# EAGLE design ch552_atmega328p (EAGLE 9.5.0)
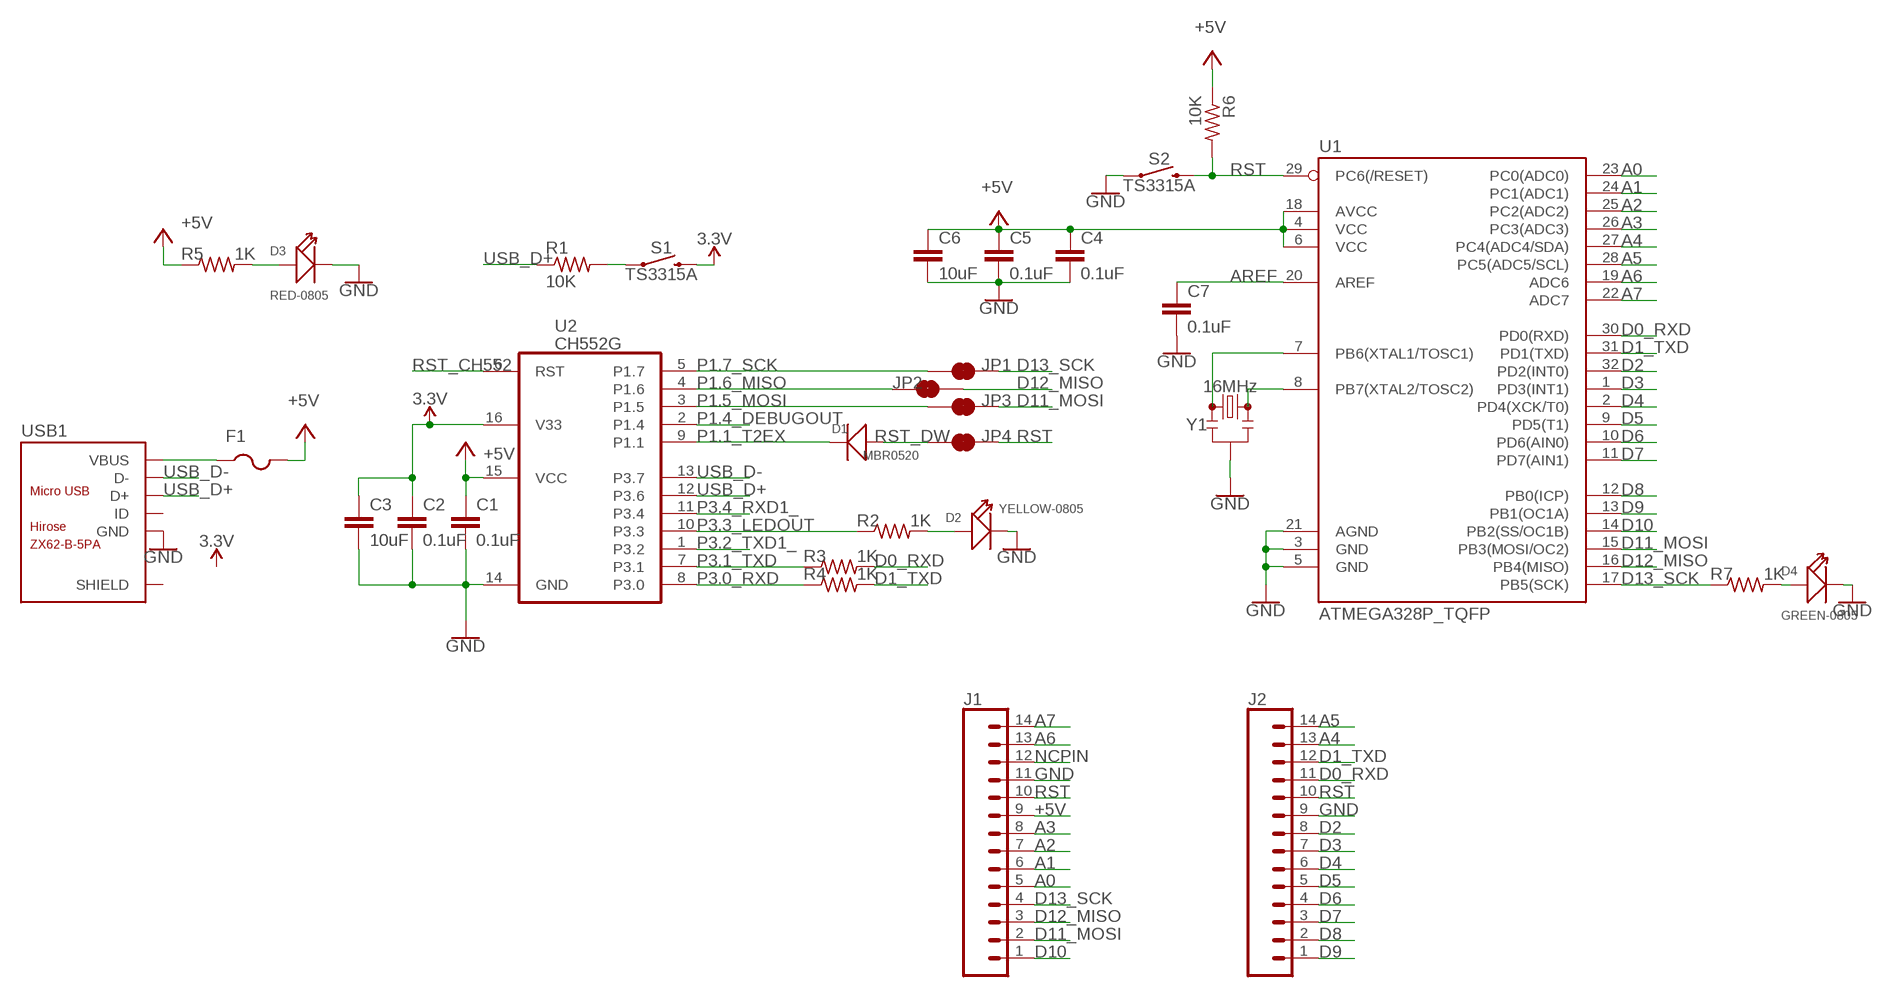
[diagram p0: schematic, sheet 1]

## Parts
C1  0.1uF  C-EUC0805K  [C0805K]
C2  0.1uF  C-EUC0805K  [C0805K]
C3  10uF  C-EUC0805K  [C0805K]
C4  0.1uF  C-EUC0805K  [C0805K]
C5  0.1uF  C-EUC0805K  [C0805K]
C6  10uF  C-EUC0805K  [C0805K]
C7  0.1uF  C-EUC0805K  [C0805K]
D1  MBR0520  SMD-DIODE-100V-200MA(SOD-123)  [SOD-123]
D2  YELLOW-0805  SMD-LED-CLEAR-YELLOW(0805)  [LED-0805]
D3  RED-0805  SMD-LED-CLEAR-RED(0805)  [LED-0805]
D4  GREEN-0805  SMD-LED-CLEAR-GREEN(0805)  [LED-0805]
F1  PTCFUSE-1206  [R1206]
J1  CONN_14NO_SILK  [1X14_NO_SILK]
J2  CONN_14NO_SILK  [1X14_NO_SILK]
JP1  JUMPER-SMT_2_NC_TRACE_NO-SILK  [SMT-JUMPER_2_NC_TRACE_NO-SILK]
JP2  JUMPER-SMT_2_NC_TRACE_NO-SILK  [SMT-JUMPER_2_NC_TRACE_NO-SILK]
JP3  JUMPER-SMT_2_NC_TRACE_NO-SILK  [SMT-JUMPER_2_NC_TRACE_NO-SILK]
JP4  JUMPER-SMT_2_NC_TRACE_NO-SILK  [SMT-JUMPER_2_NC_TRACE_NO-SILK]
R1  10K  R-US_R0805  [R0805]
R2  1K  R-US_R0805  [R0805]
R3  1K  R-US_R0805  [R0805]
R4  1K  R-US_R0805  [R0805]
R5  1K  R-US_R0805  [R0805]
R6  10K  R-US_R0805  [R0805]
R7  1K  R-US_R0805  [R0805]
S1  TS3315A  MOMENTARY-SWITCH-SPST  [TACTILE_SWITCH_SMD_3.3MM]
S2  TS3315A  MOMENTARY-SWITCH-SPST  [TACTILE_SWITCH_SMD_3.3MM]
U1  ATMEGA328P_TQFP  [TQFP32-08]
U2  CH552G  MY_IC_CH551G_CH552GSOP-16  [MY_IC_SO16]
USB1  ZX62-B-5PA  MICRO-USB-SMD(ZX62-B-5PA)  [MICRO-USB5+6P-SMD-0.65-AB]
Y1  16MHz  RESONATOR-16MHZSMD_3.2X1.3  [RESONATOR-SMD-3.2X1.3]

## Nets
3.3V: C2.1 C3.1 S1.3 U2.16(V33)
+5V: C1.1 C4.1 C5.1 C6.1 F1.2 J1.9 R5.1 R6.1 U1.4(VCC) U1.6(VCC) U1.18(AVCC) U2.15(VCC)
A0: J1.5 U1.23(PC0(ADC0))
A1: J1.6 U1.24(PC1(ADC1))
A2: J1.7 U1.25(PC2(ADC2))
A3: J1.8 U1.26(PC3(ADC3))
A4: J2.13 U1.27(PC4(ADC4/SDA))
A5: J2.14 U1.28(PC5(ADC5/SCL))
A6: J1.13 U1.19(ADC6)
A7: J1.14 U1.22(ADC7)
AREF: C7.1 U1.20(AREF)
D0_RXD: J2.11 R3.2 U1.30(PD0(RXD))
D1_TXD: J2.12 R4.2 U1.31(PD1(TXD))
D2: J2.8 U1.32(PD2(INT0))
D3: J2.7 U1.1(PD3(INT1))
D4: J2.6 U1.2(PD4(XCK/T0))
D5: J2.5 U1.9(PD5(T1))
D6: J2.4 U1.10(PD6(AIN0))
D7: J2.3 U1.11(PD7(AIN1))
D8: J2.2 U1.12(PB0(ICP))
D9: J2.1 U1.13(PB1(OC1A))
D10: J1.1 U1.14(PB2(SS/OC1B))
D11_MOSI: J1.2 JP3.2 U1.15(PB3(MOSI/OC2))
D12_MISO: J1.3 JP2.2 U1.16(PB4(MISO))
D13_SCK: J1.4 JP1.2 R7.1 U1.17(PB5(SCK))
GND: C1.2 C2.2 C3.2 C4.2 C5.2 C6.2 C7.2 D2.- D3.- D4.- J1.11 J2.9 S2.1 U1.3(GND) U1.5(GND) U1.21(AGND) U2.14(GND) USB1.5(GND) Y1.2
N$1: R1.2 S1.1
N$2: D2.+ R2.2
N$3: D3.+ R5.2
N$4: D4.+ R7.2
N$5: U1.8(PB7(XTAL2/TOSC2)) Y1.3
N$6: U1.7(PB6(XTAL1/TOSC1)) Y1.1
NCPIN: J1.12
P1.1_T2EX: D1.- U2.9(P1.1)
P1.4_DEBUGOUT: U2.2(P1.4)
P1.5_MOSI: JP3.1 U2.3(P1.5)
P1.6_MISO: JP2.1 U2.4(P1.6)
P1.7_SCK: JP1.1 U2.5(P1.7)
P3.0_RXD: R4.1 U2.8(P3.0)
P3.1_TXD: R3.1 U2.7(P3.1)
P3.2_TXD1_: U2.1(P3.2)
P3.3_LEDOUT: R2.1 U2.10(P3.3)
P3.4_RXD1_: U2.11(P3.4)
RST: J1.10 J2.10 JP4.2 R6.2 S2.3 U1.29(PC6(/RESET))
RST_CH552: U2.6(RST)
RST_DW: D1.+ JP4.1
USB_D+: R1.1 U2.12(P3.6) USB1.3(D+)
USB_D-: U2.13(P3.7) USB1.2(D-)
VBUS: F1.1 USB1.1(VBUS)
Unconnected: USB1.4(ID) USB1.P1(SHIELD) USB1.P2(SHIELD) USB1.P3(SHIELD) USB1.P4(SHIELD) USB1.P5(SHIELD) USB1.P6(SHIELD)

## Library data of the parts
C1 C2 C4 C5 C7 = rcl:C-EU: CAPACITOR, European symbol; LCSC: C16834; SPICEPREFIX: C
C3 C6 = rcl:C-EU: CAPACITOR, European symbol; LCSC: C307525; SPICEPREFIX: C
D1 = Seeed-Diode:SMD-DIODE-100V-200MA(SOD-123): 304010007; MPN: MMSD4148; VALUE: MMSD4148-sod123
D2 = Seeed-LED:SMD-LED-CLEAR-YELLOW(0805): 304090039; MPN: 17-215UYC/S530-A3/TR8
D3 = Seeed-LED:SMD-LED-CLEAR-RED(0805): 304090046; MPN: 17-215SURC/S530-A2/TR8
D4 = Seeed-LED:SMD-LED-CLEAR-GREEN(0805): 304090057; MPN: 17-215SYGC/S530-E2/TR8
F1 = adafruit:PTCFUSE: PTC fuses, resettable thermistors; LCSC: C151162
J1 J2 = SparkFun-Connectors:CONN_14: Multi connection point. Often used as Generic Header-pin footprint for 0.1 inch spaced/style header connections On any of the 0.1 inch spaced packages, you can populate with these: Break Away Headers - Straight <https://www.sparkfun.com/products/116> (PRT-00116) Break Away Male Headers - Right Angle <https://www.sparkfun.com/products/553> (PRT-00553) Female Headers <https://www.sparkfun.com/products/115> (PRT-00115) Break Away Headers - Machine Pin <https://www.sparkfun.com/products/117> (PRT-00117) Break Away Female Headers - Swiss Machine Pin <https://www.sparkfun.com/products/743> (PRT-00743) For SCREWTERMINALS and SPRING TERMINALS visit here: Screw Terimnals on SparkFun.com <https://www.sparkfun.com/search/results?term=Screw+Terminals> (5mm/3.5mm/2.54mm spacing) This device is also useful as a general connection point to wire up your design to another part of your project. Our various solder wires solder well into these plated through hole pads. Hook-Up Wire - Assortment (Stranded, 22 AWG) <https://www.sparkfun.com/products/11375> (PRT-11375) Hook-Up Wire - Assortment (Solid Core, 22 AWG) <https://www.sparkfun.com/products/11367> (PRT-11367) View the entire wire category on our website here <https://www.sparkfun.com/categories/141> Special notes: Molex polarized connector foot print use with SKU : PRT-08231 with associated crimp pins and housings. 1MM SMD Version SKU: PRT-10208 NOTES ON THE VARIANTS LOCK and LOCK_LONGPADS... This footprint was designed to help hold the alignment of a through-hole component (i.e. 6-pin header) while soldering it into place. You may notice that each hole has been shifted either up or down by 0.005 of an inch from it's more standard position (which is a perfectly straight line). This slight alteration caused the pins (the squares in the middle) to touch the edges of the holes. Because they are alternating, it causes a "brace" to hold the component in place. 0.005 has proven to be the perfect amount of "off-center" position when using our standard breakaway headers. Although looks a little odd when you look at the bare footprint, once you have a header in there, the alteration is very hard to notice. Also,if you push a header all the way into place, it is covered up entirely on the bottom side.
JP1-JP4 = SparkFun-Jumpers:JUMPER-SMT_2_NC_TRACE: Normally closed trace jumper This jumper has a trace between two pads so it's normally closed (NC). Use a razor knife to open the connection. For best results follow the IPC guidelines for cutting traces: Cutout at least 0.063 mm (0.005 in). Remove all loose material to clean up the cut area. Seal the cut with an approved epoxy. Reapply solder to reclose the connection.
R1-R7 = rcl:R-US_: RESISTOR, American symbol; SPICEPREFIX: R
S1 S2 = myOwnLib:MOMENTARY-SWITCH-SPST: Momentary Switch (Pushbutton) - SPST Normally-open (NO) SPST momentary switches (buttons, pushbuttons). Variants PTH-12MM - 12mm square, through-hole Momentary Pushbutton Switch - 12mm Square <https://www.sparkfun.com/products/9190> (COM-09190) PTH-6.0MM, PTH-6.0MM-KIT - 6.0mm square, through-hole Mini Pushbutton Switch <https://www.sparkfun.com/products/97> (COM-00097) KIT package intended for soldering kit's - only one side of pads' copper is exposed. PTH-RIGHT-ANGLE-KIT - Right-angle, through-hole Right Angle Tactile Button <https://www.sparkfun.com/products/10791> - Used on SparkFun BigTime Watch Kit <https://www.sparkfun.com/products/11734> SMD-12MM - 12mm square, surface-mount Tactile Button - SMD (12mm) <https://www.sparkfun.com/products/12993> (COM-12993) Used on SparkFun PicoBoard <https://www.sparkfun.com/products/11888> SMD-4.5MM - 4.5mm Square Trackball Switch Used on SparkFun Blackberry Trackballer Breakout <https://www.sparkfun.com/products/13169> SMD-4.6MMX2.8MM - 4.60mm x 2.80mm, surface mount Used on SparkFun SAMD21 Mini Breakout <https://www.sparkfun.com/products/13664> SMD-5.2MM, SMD-5.2-REDUNDANT - 5.2mm square, surface-mount Mini Pushbutton Switch - SMD <https://www.sparkfun.com/products/8720> (COM-08720) Used on Arduino Pro Mini <https://www.sparkfun.com/products/11114> REDUNDANT package connects both switch circuits together SMD-6.0X3.5MM - 6.0 x 3.5mm, surface mount Momentary Reset Switch SMD <https://www.sparkfun.com/products/8229> (COM-08229) SMD-6.2MM-TALL - 6.2mm square, surface mount Tactile Button - SMD (6mm) <https://www.sparkfun.com/products/12992> Used on SparkFun Digital Sandbox <https://www.sparkfun.com/products/12651> SMD-RIGHT-ANGLE - Right-angle, surface mount Used on SparkFun Block for Intel® Edison - Arduino <https://www.sparkfun.com/products/13036>; LCSC: C412367
U1 = SparkFun-IC-Microcontroller:ATMEGA328P_TQFP: Popular 328P in QFP Storefront component: ATmega328 - TQFP <https://www.sparkfun.com/products/13448> (COM-13448) Datasheet <http://www.sparkfun.com/datasheets/Components/SMD/ATMega328.pdf> SparkFun Products SparkFun RedBoard - Programmed with Arduino <https://www.sparkfun.com/products/12757> (DEV-12757) Arduino Pro Mini 328 - 5V/16MHz <https://www.sparkfun.com/products/11113> (DEV-11113) Arduino Pro Mini 328 - 3.3V/8MHz <https://www.sparkfun.com/products/11114> (DEV-11114) SparkFun OpenLog <https://www.sparkfun.com/products/13712> (DEV-13712) SparkFun MicroView - OLED Arduino Module <https://www.sparkfun.com/products/12923> (DEV-12923) SparkFun Digital Sandbox <https://www.sparkfun.com/products/12651> (DEV-12651) SparkFun PicoBoard <https://www.sparkfun.com/products/11888> (WIG-11888) Arduino Fio <https://www.sparkfun.com/products/10116> (DEV-10116) LilyPad Arduino 328 Main Board <https://www.sparkfun.com/products/13342> (DEV-13342) SparkFun RedStick <https://www.sparkfun.com/products/13741> (DEV-13741) LilyPad MP3 <https://www.sparkfun.com/products/11013> (DEV-11013) LilyPad Arduino SimpleSnap <https://www.sparkfun.com/products/10941> (DEV-10941) SparkFun Stepoko <https://www.sparkfun.com/products/13899> (ROB-13899) SparkFun Geiger Counter <https://www.sparkfun.com/products/11345> (SEN-11345) SparkFun EL Sequencer <https://www.sparkfun.com/products/12781> (COM-12781) Arduino Pro 328 - 5V/16MHz <https://www.sparkfun.com/products/10915> (DEV-10915) CryptoCape <https://www.sparkfun.com/products/12773> (DEV-12773) SparkFun IR Thermometer Evaluation Board - MLX90614 <https://www.sparkfun.com/products/10740> (SEN-10740) SparkFun RedBot Mainboard <https://www.sparkfun.com/products/12097> (ROB-12097) Arduino Pro 328 - 3.3V/8MHz <https://www.sparkfun.com/products/10914> (DEV-10914) SparkFun Block for Intel® Edison - Arduino <https://www.sparkfun.com/products/13036> (DEV-13036) SparkFun Simon Says - Surface Mount Soldering Kit <https://www.sparkfun.com/products/10935> (KIT-10935) SparkFun 7-Segment Serial Display - Red <https://www.sparkfun.com/products/11441> (COM-11441) SparkFun 7-Segment Serial Display - White <https://www.sparkfun.com/products/11629> (COM-11629) SparkFun 7-Segment Serial Display - Yellow <https://www.sparkfun.com/products/11443> (COM-11443) SparkFun 7-Segment Serial Display - Kelly Green <https://www.sparkfun.com/products/11440> (COM-11440) SparkFun 7-Segment Serial Display - Blue <https://www.sparkfun.com/products/11442> (COM-11442) SparkFun OpenSegment Serial Display - 20mm (Blue) <https://www.sparkfun.com/products/11647> (COM-11647) SparkFun OpenSegment Serial Display - 20mm (Green) <https://www.sparkfun.com/products/11646> (COM-11646) SparkFun OpenSegment Serial Display - 20mm (White) <https://www.sparkfun.com/products/11648> (COM-11648) SparkFun OpenSegment Serial Display - 20mm (Red) <https://www.sparkfun.com/products/11644> (COM-11644) SparkFun OpenSegment Serial Display - 20mm (Yellow) <https://www.sparkfun.com/products/11645> (COM-11645) SparkFun OpenSegment Shield <https://www.sparkfun.com/products/13190> (DEV-13190); PROD_ID: IC-09069
U2 = myOwnLib:MY_IC_CH551G_CH552G; LCSC: C111292
USB1 = microusbConnector:MICRO-USB-SMD(ZX62-B-5PA): 320010005; LCSC: C10418; MPN: ZX62-B-5PA
Y1 = SparkFun-Clocks:RESONATOR-16MHZ: 16MHz Resonator Digikey Example <http://www.digikey.com/product-detail/en/murata-electronics-north-america/CSTCE16M0V53-R0/490-1198-1-ND/584635> Frequency: 16MHz Frequency Stability: ±0.3% Frequency Tolerance: ±0.5% Capacitance: 15pF SparkFun Products SparkFun OpenLog <https://www.sparkfun.com/products/13712> SparkFun MicroView - OLED Arduino Module <https://www.sparkfun.com/products/12923>; PROD_ID: XTAL-08900

## Board
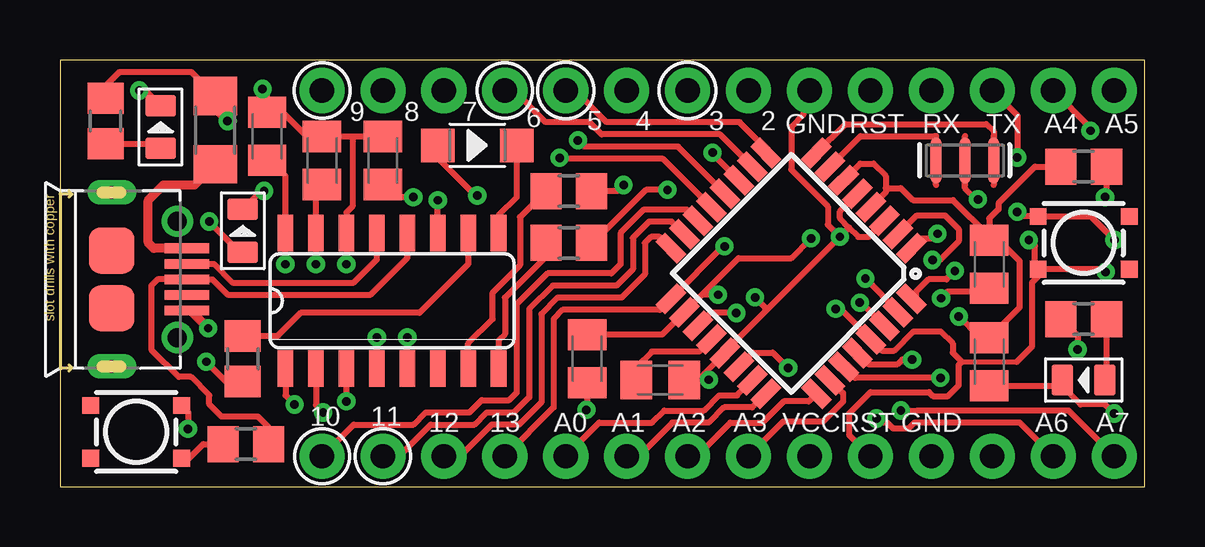
[diagram p1: board, top side]
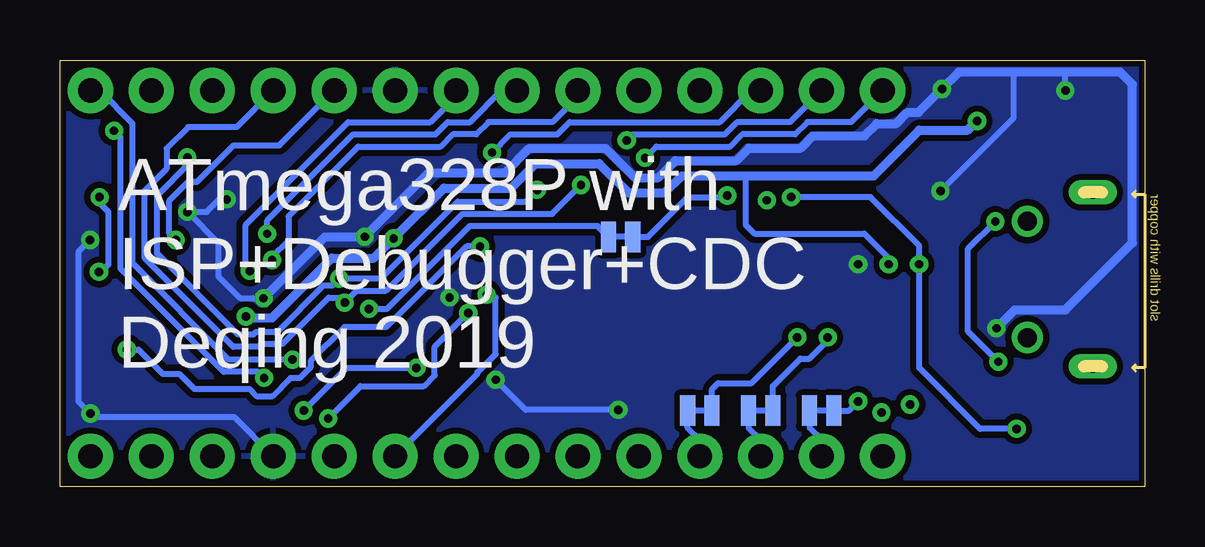
[diagram p2: board, bottom side, seen from below]

Size 45.21 x 17.78 mm. Coordinates in mm from the lower left corner, seen from the top.
Outline: 0,0 45.21,0 45.21,17.78 0,17.78 0,0
Copper layers (1*16): Top 0.035mm / dielectric 1.5mm / Bottom 0.035mm
Design rules "eagleRules10Mil *": minimum track width 10mil, minimum drill 0.3mm, track to track 10mil, track to pad 10mil, pad to pad 8mil, via to via 10mil, smd to smd 0mil, copper to edge 10mil, drill to drill 10mil, minimum pad ring 10mil, minimum via ring 8mil, stop-mask expansion 4mil, vias tented up to drill 14mil, thermal gap 10mil

### Footprints (pad centres in the part's own frame; a part is rotated, then mirrored left to right if it is on the bottom)
C0805K = smd 1.3 x 1.6: 1 -1,0; 2 1,0
SOD-123 = smd 1.397 x 1.397: + -1.651,0; - 1.651,0
LED-0805 = smd 0.889 x 1.27: + -0.889,0; - 0.889,0
R1206 = smd 1.6 x 1.803: 1 -1.422,0; 2 1.422,0
1X14_NO_SILK = drill 1.016 pad 1.88: 1 0,0; 2 2.54,0; 3 5.08,0; 4 7.62,0; 5 10.16,0; 6 12.7,0; 7 15.24,0; 8 17.78,0; 9 20.32,0; 10 22.86,0; 11 25.4,0; 12 27.94,0; 13 30.48,0; 14 33.02,0
SMT-JUMPER_2_NC_TRACE_NO-SILK = smd 0.635 x 1.27: 1 -0.508,0; 2 0.508,0
R0805 = smd 1.3 x 1.5: 1 -0.95,0; 2 0.95,0
TACTILE_SWITCH_SMD_3.3MM = smd 0.7 x 0.7: 1 -1.9,1.1; 2 1.9,1.1; 3 -1.9,-1.1; 4 1.9,-1.1
TQFP32-08 = smd 1.27 x 0.559: 1 -4.293,2.8; 2 -4.293,2; 3 -4.293,1.2; 4 -4.293,0.4; 5 -4.293,-0.4; 6 -4.293,-1.2; 7 -4.293,-2; 8 -4.293,-2.8; 17 4.293,-2.8; 18 4.293,-2; 19 4.293,-1.2; 20 4.293,-0.4; 21 4.293,0.4; 22 4.293,1.2; 23 4.293,2; 24 4.293,2.8 | smd 0.559 x 1.27: 9 -2.8,-4.293; 10 -2,-4.293; 11 -1.2,-4.293; 12 -0.4,-4.293; 13 0.4,-4.293; 14 1.2,-4.293; 15 2,-4.293; 16 2.8,-4.293; 25 2.8,4.293; 26 2,4.293; 27 1.2,4.293; 28 0.4,4.293; 29 -0.4,4.293; 30 -1.2,4.293; 31 -2,4.293; 32 -2.8,4.293
MY_IC_SO16 = smd 0.66 x 1.524: 1 -4.445,-2.819; 2 -3.175,-2.819; 3 -1.905,-2.819; 4 -0.635,-2.819; 5 0.635,-2.819; 6 1.905,-2.819; 7 3.175,-2.819; 8 4.445,-2.819; 9 4.445,2.819; 10 3.175,2.819; 11 1.905,2.819; 12 0.635,2.819; 13 -0.635,2.819; 14 -1.905,2.819; 15 -3.175,2.819; 16 -4.445,2.819
MICRO-USB5+6P-SMD-0.65-AB = smd 0.4 x 1.858: 1 -1.3,3.129; 2 -0.65,3.129; 3 0,3.129; 4 0.65,3.129; 5 1.3,3.129 | smd 1.9 x 1.9: P1 -1.2,0; P2 1.2,0 | drill 0.508 pad 1.016 long: P3 -3.625,0; P4 3.625,0 | drill 0.8: P5 -2.425,2.73; P6 2.425,2.73
RESONATOR-SMD-3.2X1.3 = smd 0.45 x 1.905: 1 -1.2,0; 2 0,0; 3 1.2,0

### Placement (x,y rotation side)
C1  10.92,13.59 90 top
C2  8.64,14.61 90 top
C3  13.46,13.59 90 top
C4  38.73,9.27 270 top
C5  21.97,5.33 270 top
C6  38.73,5.21 270 top
C7  25.02,4.45 0 top
D1  17.4,14.22 0 top
D2  7.62,10.67 90 top
D3  4.19,14.99 90 top
D4  42.67,4.45 180 top
F1  6.48,14.86 90 top
J1  10.92,1.27 0 top
J2  10.92,16.51 0 top
JP1  18.54,3.17 180 bottom
JP2  16,3.17 180 bottom
JP3  13.46,3.17 180 bottom
JP4  21.84,10.41 180 bottom
R1  7.75,1.78 180 top
R2  7.62,5.33 270 top
R3  21.21,12.32 0 top
R4  21.21,10.16 0 top
R5  1.91,15.24 270 top
R6  42.67,13.34 0 top
R7  42.67,6.99 0 top
S1  3.17,2.29 180 top
S2  42.67,10.16 0 top
U1  30.48,8.89 225 top
U2  13.84,7.75 0 top
USB1  2.16,8.64 270 top
Y1  37.72,13.59 0 top

### Tracks (layer width: path | path; a pad name or v marks a point on that pad's centre or on a via)
3.3V  (via drill 0.35)
  Top 0.254: S1.3 5.33,3.13 v5.33,2.41 | v9.4,9.27 U2.16 9.4,12.95 9.14,13.21 8.75,13.61 C2.1 | v14.73,12.06 13.99,12.06 C3.1
  Bottom 0.254: v5.33,2.41 6.86,2.41 9.4,4.95 v9.4,9.27 9.4,10.03 11.43,12.06 v14.73,12.06
+5V  (via drill 0.35)
  Top 0.254: U1.4 34.42,12.26 34.42,12.45 | 34.42,12.45 35.05,12.45 35.56,11.94 37.23,11.94 38.73,10.43 C4.1 | C4.1 38.73,11.18 39.12,11.56 39.12,11.81 40.64,13.34 R6.1 | C4.1 39.13,10.27 40.01,9.4 40.01,7.48 C6.1 | 38.35,6.21 v37.47,7.09 | U1.6 33.35,13.46 33.91,13.46 34.42,12.95 34.42,12.45 | 26.76,8 28.29,9.53 30.48,9.53 v31.3,10.35 | 26.76,8 U1.18 25.1,6.33 C5.1 | v27.43,8 26.76,8 | C1.1 10.67,12.34 U2.15 v10.67,9.27 | R5.1 1.91,16.7 2.48,17.27 5.49,17.27 6.3,16.46 F1.2 6.99,15.77 v6.99,15.24
  Top 0.381: C6.1 38.35,6.21 | v6.99,15.24 6.3,15.93 6.3,16.46
  Bottom 0.254: J1.9 27.81,4.7 27.81,4.77 27.05,5.53 27.05,7.87 27.18,8 v27.43,8 | 16.64,12.95 16.64,10.92 16.26,10.54 11.68,10.54 10.67,9.53 v10.67,9.27
  Bottom 0.381: v37.47,7.09 37.4,7.03 36.38,7.03 33.89,9.53 32.13,9.53 v31.3,10.35 29.21,12.45 26.41,12.45 25.39,13.46 22.73,13.46 21.52,12.24 20,12.24 19.3,12.95 16.64,12.95 11.29,12.95 9.39,14.85 7.37,14.85 v6.99,15.24
A0
  Top 0.254: J1.5 22.48,2.67 24.68,2.67 25.19,3.17 26.84,3.17 27.48,3.81 28.23,3.81 U1.23
A1
  Top 0.254: U1.24 28.85,3.3 27.69,3.3 27.05,2.67 25.53,2.67 24.13,1.27 J1.6
A2
  Top 0.254: U1.25 31.22,3.56 30.17,3.56 29.28,2.67 27.94,2.67 26.67,1.4 26.29,1.4 J1.7
A3
  Top 0.254: U1.26 32.64,3.9 32.64,3.54 31.82,2.72 30.16,2.72 J1.8
A4  (via drill 0.35)
  Top 0.254: v36.7,4.53 33.14,4.53 U1.27 | J2.13 42.95,14.96 v42.95,14.83
  Bottom 0.254: v36.7,4.53 36.95,4.79 38.38,4.79 42.69,9.09 42.69,14.57 v42.95,14.83
A5  (via drill 0.35)
  Top 0.254: v35.52,5.29 35.11,5.29 34.93,5.11 33.69,5.11 U1.28
  Bottom 0.254: v35.52,5.29 38.17,5.29 42.18,9.3 42.18,15.13 43.56,16.51 J2.14
A6  (via drill 0.35)
  Top 0.254: J1.13 40,2.67 35.94,2.67 35.62,2.67 35.37,2.42 34.74,2.42 34.48,2.67 34.16,2.67 34.04,2.79 v34.04,2.84 | v28.19,7.24 27.13,7.24 U1.19
  Bottom 0.254: v34.04,2.84 32.68,4.19 30.04,4.19 29.59,4.64 29.59,5.84 v28.19,7.24
A7  (via drill 0.35)
  Top 0.254: J1.14 42.04,3.18 35.73,3.18 35.73,3.17 v35.05,3.17 | U1.22 28.88,5.59 29.72,5.59 v30.35,4.95
  Bottom 0.254: v35.05,3.17 33.27,4.95 v30.35,4.95
AREF
  Top 0.254: U1.20 26.65,5.63 24.68,5.63 24.02,4.97 C7.1
D0_RXD  (via drill 0.35)
  Top 0.254: v33.34,7.67 33.4,7.67 U1.30 | v23.5,12.57 23.24,12.32 R3.2
  Bottom 0.254: J2.11 37.85,14.99 39.88,14.99 40.77,14.1 40.77,13.25 41.67,12.34 41.67,9.51 37.99,5.83 36.94,5.83 36.82,5.95 35.94,5.95 34.01,7.88 33.55,7.88 v33.34,7.67 32.84,8.17 31.62,8.17 28.43,11.37 24.7,11.37 v23.5,12.57
D1_TXD  (via drill 0.35)
  Top 0.254: J2.12 39.9,15.47 v39.9,13.72 | v33.57,8.68 34.93,7.32 U1.31 | v25.32,12.37 24.43,12.37 22.23,10.16 R4.2
  Bottom 0.254: v39.9,13.72 39.83,13.64 39.83,13.47 41.17,12.13 41.17,9.72 37.78,6.33 37.15,6.33 37.03,6.46 36.15,6.46 34.22,8.38 33.87,8.38 v33.57,8.68 31.83,8.68 28.64,11.87 25.82,11.87 v25.32,12.37
D2  (via drill 0.35)
  Top 0.254: U1.32 35.69,7.83 35.69,8.13 36.2,8.64 36.95,8.64 v37.3,8.99
  Bottom 0.254: v37.3,8.99 37.47,9.16 37.47,10.92 33.2,15.19 29.77,15.19 28.7,16.26 J2.8
D3  (via drill 0.35)
  Top 0.254: U1.1 35.89,10.34 36.37,10.34 v36.58,10.54
  Bottom 0.254: v36.58,10.54 36.58,11.09 32.99,14.68 29.56,14.68 29.05,15.19 28.12,15.19 26.8,16.51 J2.7
D4  (via drill 0.35)
  Top 0.254: U1.2 35.72,11.3 36.89,11.3 37.46,10.73 37.46,10.23 36.68,9.45 v36.37,9.45
  Bottom 0.254: v36.37,9.45 36.37,9.57 35.69,10.25 35.69,11.26 32.78,14.17 29.35,14.17 28.84,14.68 27.86,14.68 27.36,15.19 24.69,15.19 23.62,16.26 J2.6
D5
  Top 0.254: U1.9 29.43,14.09 28.32,15.19 22.78,15.19 21.46,16.51 J2.5
D6
  Top 0.254: J2.4 18.92,16.51 20.24,15.19 22.07,15.19 22.57,14.68 27.52,14.68 U1.10
D7  (via drill 0.35)
  Top 0.254: U1.11 27.2,13.86 v27.2,13.92
  Bottom 0.254: v27.2,13.92 26.44,14.68 24.48,14.68 23.97,15.19 17.7,15.19 16.38,16.51 J2.3
D8  (via drill 0.35)
  Top 0.254: U1.12 25.76,14.17 21.85,14.17 v21.59,14.43
  Bottom 0.254: J2.2 14.78,15.19 16.98,15.19 17.49,14.68 21.34,14.68 v21.59,14.43
D9  (via drill 0.35)
  Top 0.254: U1.13 25.14,13.66 20.86,13.66 v20.83,13.7
  Bottom 0.254: J2.1 12.24,15.19 14.06,15.19 14.57,14.68 16.77,14.68 17.28,14.17 20.36,14.17 v20.83,13.7
D10
  Top 0.254: J1.1 12.24,2.59 14.74,2.59 15.24,3.1 17.07,3.1 17.57,3.61 18.72,3.61 19.05,3.93 19.05,7.62 20.32,8.89 22.99,8.89 23.37,9.27 23.37,10.58 24.34,11.56 26.12,11.56 U1.14
D11_MOSI
  Top 0.254: U1.15 25.49,11.05 24.55,11.05 23.88,10.37 23.88,9.06 23.2,8.38 20.53,8.38 19.56,7.41 19.56,3.72 18.93,3.1 17.78,3.1 17.28,2.59 15.46,2.59 14.13,1.27 J1.2
  Bottom 0.254: J1.2 13.46,1.95 13.97,2.46 JP3.2
D12_MISO
  Top 0.254: U1.16 25,10.41 24.64,10.41 24.38,10.16 24.38,8.85 23.41,7.87 20.75,7.87 20.07,7.2 20.07,3.51 19.14,2.59 18,2.59 16.67,1.27 J1.3
  Bottom 0.254: J1.3 16,1.95 16.51,2.46 JP2.2 16.51,3.68
D13_SCK  (via drill 0.35)
  Top 0.254: R7.1 42.42,6.29 v42.42,5.71 | J1.4 20.57,3.3 20.57,6.99 20.95,7.37 25,7.37 U1.17 27.65,10.02 v27.7,10.02
  Bottom 0.254: v42.42,5.71 41.94,5.71 40.92,4.7 40.24,4.7 39.62,4.07 37.31,4.07 37.02,3.77 36.36,3.77 35.6,4.53 35.2,4.53 34.76,4.98 34.76,5.25 33.35,6.65 31.62,6.65 28.25,10.02 v27.7,10.02 | J1.4 18.54,1.95 19.05,2.46 JP1.2 19.05,3.68
GND  (via drill 0.35)
  Top 0.254: 32.89,10.79 32.51,11.18 32.51,11.49 U1.5 | 32.89,10.79 33.27,10.41 33.7,10.41 U1.3 | 32.89,10.79 v32.51,10.41 | J2.9 30.99,16.26 30.99,15.49 30.48,14.99 30.48,13.21 32,11.68 32,10.92 v32.51,10.41 | C6.2 41.55,4.21 41.66,4.32 | 41.66,4.32 D4.- | v39.9,11.45 40.09,11.26 S2.1 42.98,11.26 v43.96,10.28 | v43.94,3.05 43.56,3.43 42.55,3.43 41.66,4.32 | v38.26,11.97 38.19,11.97 37.72,12.45 Y1.2 | C4.2 38.59,8.13 37,8.13 v36.73,7.85 | v32.51,10.41 29.4,7.3 | 29.4,7.3 27.73,5.63 U1.21 26.89,4.73 | 26.89,4.73 26.6,4.45 C7.2 | 26.89,4.73 26.89,4.62 v27.05,4.46 | C5.2 21.97,3.23 v21.94,3.2 | 29.4,7.3 29.4,7.46 v28.97,7.89 | v11.94,9.27 U2.14 11.94,11.43 12.19,11.68 12.19,14.59 | D3.- 3.55,16.51 v3.3,16.51 | C3.2 12.19,14.59 | 12.19,14.59 C1.2 10.3,14.59 9.29,15.61 C2.2 8.64,16.38 v8.45,16.57 | D2.- 8.38,12.32 v8.51,12.32
  Top 0.381: USB1.5 5.44,7.34 v6.17,6.6
  Bottom 0.254: v43.96,10.28 44.45,9.79 44.45,3.56 v43.94,3.05 43.8,2.91 37.96,2.91 J1.11 | v38.26,11.97 38.57,11.97 39.09,11.45 v39.9,11.45 38.61,10.16 38.61,8.76 37.7,7.85 37.15,7.85 v36.73,7.85 | v21.94,3.2 25.8,3.2 v27.05,4.46 | v3.3,16.51 3.3,17.14 3.43,17.27 | v8.51,12.32 5.46,15.37 5.46,17.27
  Bottom 0.381: v36.73,7.85 34.16,10.41 v32.51,10.41 29.84,13.08 26.67,13.08 25.65,14.1 22.47,14.1 21.27,12.89 21.18,12.89 21.17,12.88 20.27,12.88 19.56,13.59 17.02,13.59 16.5,14.11 14.34,14.11 13.83,14.62 11.67,14.62 11.16,15.13 10.35,15.13 9.88,15.6 9.42,15.6 v8.45,16.57 7.75,17.27 5.46,17.27 3.43,17.27 1.02,17.27 0.51,16.76 0.51,10.16 3.3,7.37 5.41,7.37 v6.17,6.6
  pour Bottom: 0.13,17.65 45.09,17.65 45.09,0.13 0.13,0.13
N$1
  Top 0.254: S1.1 5.38,1.19 5.97,1.78 R1.2
N$2  (via drill 0.35)
  Top 0.254: R2.2 6.92,4.38 v6.1,5.21 | v6.22,11.05 7.49,9.78 D2.+
  Bottom 0.254: v6.1,5.21 7.37,6.48 7.37,9.91 v6.22,11.05
N$3
  Top 0.254: R5.2 4,14.29 D3.+
N$4
  Top 0.254: R7.2 43.62,4.51 D4.+
N$5
  Top 0.254: U1.8 32.74,15.11 38.61,15.11 38.92,14.8 Y1.3
N$6
  Top 0.254: U1.7 33.37,14.61 36.45,14.61 36.52,14.54 Y1.1
P1.1_T2EX
  Top 0.254: U2.9 18.29,11.3 19.05,12.06 D1.-
P1.4_DEBUGOUT  (via drill 0.35)
  Top 0.254: v10.97,3.1 10.67,3.4 U2.2
P1.5_MOSI  (via drill 0.35)
  Top 0.254: v11.94,3.56 U2.3
  Bottom 0.254: JP3.1 12.32,3.17 v11.94,3.56
P1.6_MISO  (via drill 0.35)
  Top 0.254: v13.21,6.22 U2.4
  Bottom 0.254: JP2.1 15.49,4.19 14.35,5.33 13.97,5.33 13.21,6.1 v13.21,6.22
P1.7_SCK  (via drill 0.35)
  Top 0.254: U2.5 v14.48,6.22
  Bottom 0.254: v14.48,6.22 16.38,4.32 17.78,4.32 18.03,4.06 JP1.1
P3.0_RXD
  Top 0.254: R4.1 20.26,9.59 18.54,7.87 18.54,6.35 18.29,6.1 U2.8
P3.1_TXD
  Top 0.254: R3.1 19.18,11.24 19.18,9.23 18.03,8.08 18.03,6.99 17.02,5.97 U2.7
P3.2_TXD1_  (via drill 0.35)
  Top 0.254: U2.1 9.4,3.81 v9.78,3.43
P3.3_LEDOUT
  Top 0.254: U2.10 17.02,9.27 14.99,7.24 10.03,7.24 9.08,6.28 R2.1
P3.4_RXD1_  (via drill 0.35)
  Top 0.254: U2.11 v15.75,11.94
RST  (via drill 0.35)
  Top 0.203: 37.59,5.21 39.88,5.21
  Top 0.254: S2.3 40.64,9.19 40.64,10.02 v40.39,10.28 | R6.2 43.62,12.13 v43.56,12.06 | v43.59,8.95 43.48,9.06 S2.3 | S2.3 40.77,8.76 40.51,8.5 40.51,5.84 39.88,5.21 | J1.10 32.89,2.16 32.89,3.05 33.78,3.94 36.23,3.94 36.39,3.77 37.02,3.77 37.46,4.22 37.46,4.32 37.47,4.32 37.47,5.08 37.59,5.21 37.21,5.59 37.21,5.97 36.7,6.48 35.57,6.48 34.77,5.68 34.26,5.68 U1.29 32.52,7.41 v32.33,7.41
  Bottom 0.254: J2.10 36.07,14.22 37.97,14.22 39.5,12.7 39.88,12.7 40.66,11.92 40.66,10.55 v40.39,10.28 | v43.56,12.06 43.56,11.81 43.2,11.45 43.2,9.25 43.56,8.89 43.59,8.92 v43.59,8.95 | v32.33,7.41 31.58,7.41 28.13,10.86 22.8,10.86 JP4.2
RST_DW  (via drill 0.35)
  Top 0.254: D1.+ 15.75,13.72 17.33,12.13 v17.4,12.13
  Bottom 0.254: v17.4,12.13 17.46,12.06 19.05,12.06 20.7,10.41 JP4.1
USB_D+
  Top 0.254: U2.12 14.48,9.53 12.95,8 6.99,8 6.35,8.64 USB1.3 4.06,8.64 3.81,8.38 3.81,5.71 4.95,4.57 5.46,4.57 6.22,3.81 6.22,3.43 6.73,2.92 8.26,2.92 8.7,2.48 R1.1
USB_D-
  Top 0.254: U2.13 13.21,9.47 12.25,8.51 7.2,8.51 6.42,9.29 USB1.2
VBUS
  Top 0.381: USB1.1 3.91,9.94 3.68,10.16 3.68,11.94 4.32,12.57 5.61,12.57 F1.1

### Text on the board
tPlace: 9 | 8 | 7 | 6 | 5 | 4 | 3 | 2 | GND | RST | RX | TX | A4 | A5 | 10 | 11 | 12 | 13 | A0 | A1 | A2 | A3 | VCC | RST | GND | A6 | A7
bPlace: ATmega328P with / ISP+Debugger+CDC / Deqing 2019